# EAGLE design arduino_due_shield (EAGLE 9.2.2)
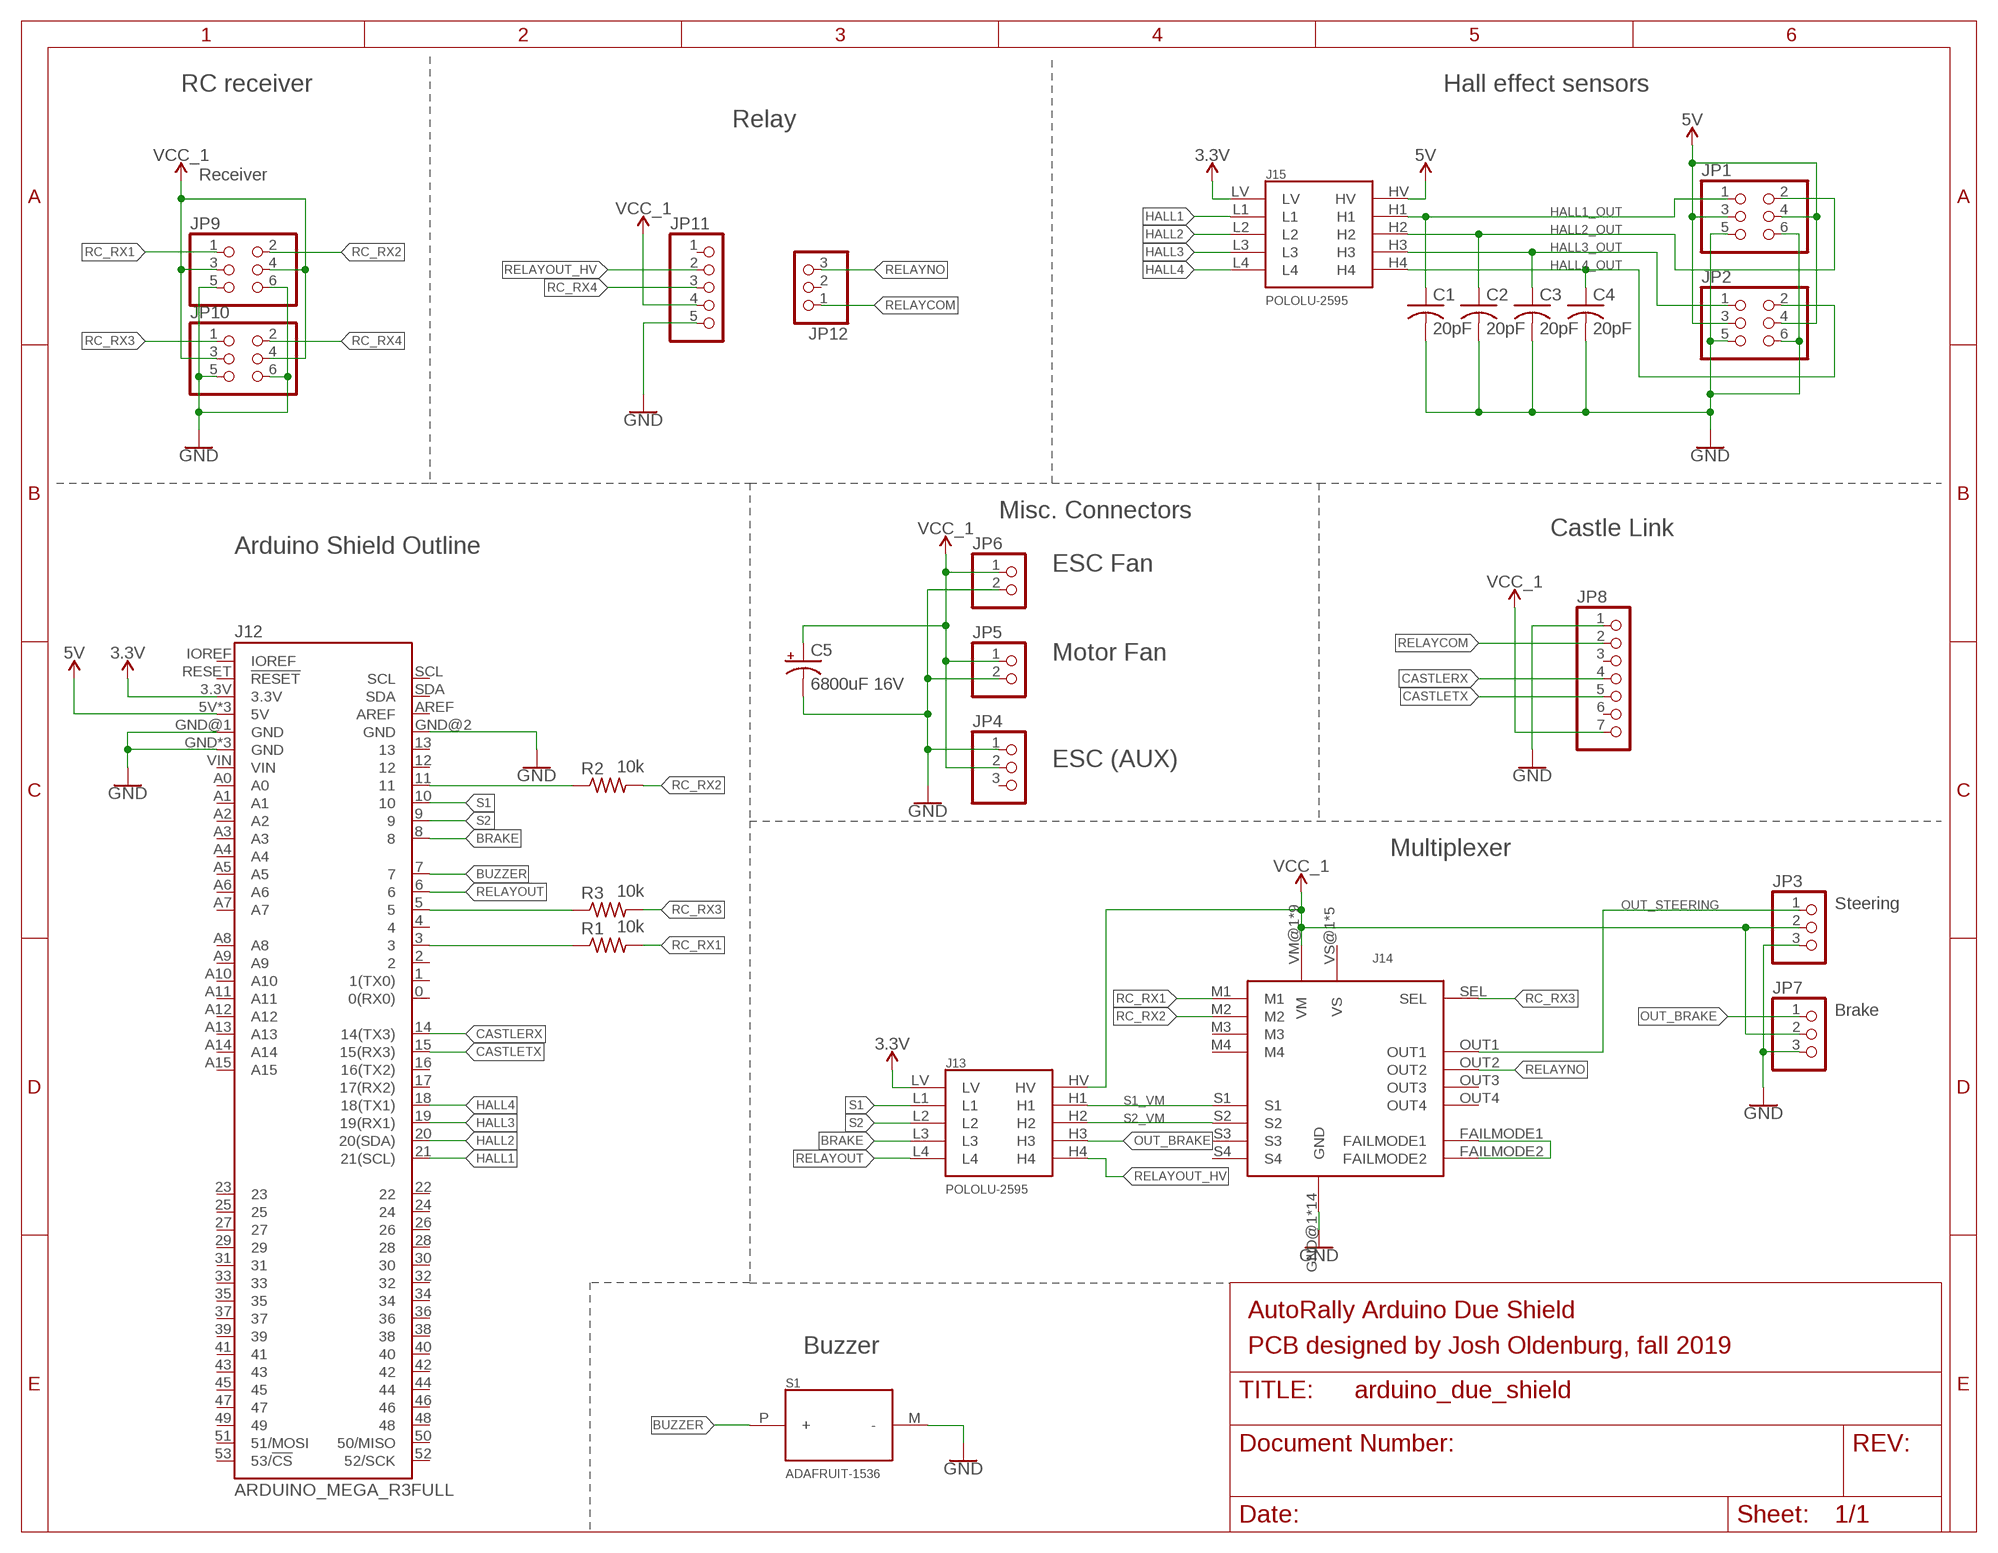
[diagram p0: schematic, sheet 1]

## Parts
C1  20pF  C-US025-030X050  [C025-030X050]
C2  20pF  C-US025-030X050  [C025-030X050]
C3  20pF  C-US025-030X050  [C025-030X050]
C4  20pF  C-US025-030X050  [C025-030X050]
C5  6800uF 16V  CPOL-USE7.5-16  [E7,5-16]
J12  ARDUINO_MEGA_R3FULL  [ARDUINO_MEGA_NO_SILK]
J13  POLOLU-2595  [POLOLU-2595-PTH]
J14  POLOLU-2807  [POLOLU-2807-PTH]
J15  POLOLU-2595  [POLOLU-2595-PTH]
JP1  PINHD-2X3  [2X03]
JP2  PINHD-2X3  [2X03]
JP3  PINHD-1X3  [1X03]
JP4  PINHD-1X3  [1X03]
JP5  PINHD-1X2  [1X02]
JP6  PINHD-1X2  [1X02]
JP7  PINHD-1X3  [1X03]
JP8  PINHD-1X7  [1X07]
JP9  PINHD-2X3  [2X03]
JP10  PINHD-2X3  [2X03]
JP11  PINHD-1X5  [1X05]
JP12  PINHD-1X3  [1X03]
R1  10k  R-US_0204/7  [0204/7]
R2  10k  R-US_0204/7  [0204/7]
R3  10k  R-US_0204/7  [0204/7]
S1  ADAFRUIT-1536  [ADAFRUIT-1536]

## Nets
3.3V: J12.3.3V J13.LV J15.LV
5V: J12.5V J12.5V@1(5V) J12.5V@2(5V) J15.HV JP1.3 JP1.4 JP2.3 JP2.4
BRAKE: J12.8 J13.L3
BUZZER: J12.7 S1.P(+)
CASTLERX: J12.14(14(TX3)) JP8.4
CASTLETX: J12.15(15(RX3)) JP8.5
GND: C1.2 C2.2 C3.2 C4.2 C5.- J12.GND J12.GND@1(GND) J12.GND@2(GND) J12.GND@3(GND) J12.GND@4(GND) J14.GND@1(GND) J14.GND@2(GND) J14.GND@3(GND) J14.GND@4(GND) J14.GND@5(GND) J14.GND@6(GND) J14.GND@7(GND) J14.GND@8(GND) J14.GND@9(GND) J14.GND@10(GND) J14.GND@11(GND) J14.GND@12(GND) J14.GND@13(GND) J14.GND@14(GND) JP1.5 JP1.6 JP2.5 JP2.6 JP3.3 JP4.1 JP5.2 JP6.2 JP7.3 JP8.1 JP9.5 JP9.6 JP10.5 JP10.6 JP11.5 S1.M(-)
HALL1: J12.21(21(SCL)) J15.L1
HALL1_OUT: C1.1 J15.H1 JP1.1
HALL2: J12.20(20(SDA)) J15.L2
HALL2_OUT: C2.1 J15.H2 JP1.2
HALL3: J12.19(19(RX1)) J15.L3
HALL3_OUT: C3.1 J15.H3 JP2.1
HALL4: J12.18(18(TX1)) J15.L4
HALL4_OUT: C4.1 J15.H4 JP2.2
N$1: J12.11 R2.1
N$2: J14.FAILMODE1 J14.FAILMODE2
N$10: J12.5 R3.1
N$11: J12.3 R1.1
OUT_BRAKE: J13.H3 JP7.1
OUT_STEERING: J14.OUT1 JP3.1
RC_RX1: J14.M1 JP9.1 R1.2
RC_RX2: J14.M2 JP9.2 R2.2
RC_RX3: J14.SEL JP10.1 R3.2
RC_RX4: JP10.2 JP11.3
RELAYCOM: JP8.2 JP12.1
RELAYNO: J14.OUT2 JP12.3
RELAYOUT: J12.6 J13.L4
RELAYOUT_HV: J13.H4 JP11.2
S1: J12.10 J13.L1
S1_VM: J13.H1 J14.S1
S2: J12.9 J13.L2
S2_VM: J13.H2 J14.S2
VCC_2: C5.+ J13.HV J14.VM@1(VM) J14.VM@2(VM) J14.VM@3(VM) J14.VM@4(VM) J14.VM@5(VM) J14.VM@6(VM) J14.VM@7(VM) J14.VM@8(VM) J14.VM@9(VM) JP3.2 JP4.2 JP5.1 JP6.1 JP7.2 JP8.7 JP9.3 JP9.4 JP10.3 JP10.4 JP11.4 ; supply symbol labelled VCC_1
Unconnected: J12.0(0(RX0)) J12.1(1(TX0)) J12.2 J12.4 J12.12 J12.13 J12.16(16(TX2)) J12.17(17(RX2)) J12.22 J12.23 J12.24 J12.25 J12.26 J12.27 J12.28 J12.29 J12.30 J12.31 J12.32 J12.33 J12.34 J12.35 J12.36 J12.37 J12.38 J12.39 J12.40 J12.41 J12.42 J12.43 J12.44 J12.45 J12.46 J12.47 J12.48 J12.49 J12.50(50/MISO) J12.51(51/MOSI) J12.52(52/SCK) J12.53(53/!CS) J12.A0 J12.A1 J12.A2 J12.A3 J12.A4 J12.A5 J12.A6 J12.A7 J12.A8 J12.A9 J12.A10 J12.A11 J12.A12 J12.A13 J12.A14 J12.A15 J12.AREF J12.IOREF J12.RESET(!RESET) J12.SCL J12.SDA J12.VIN J14.M3 J14.M4 J14.OUT3 J14.OUT4 J14.S3 J14.S4 J14.VS@1(VS) J14.VS@2(VS) J14.VS@3(VS) J14.VS@4(VS) J14.VS@5(VS) JP4.3 JP8.3 JP8.6 JP11.1 JP12.2

## Notes on the sheet
- RC receiver | Hall effect sensors
- Relay
- Receiver
- Misc. Connectors
- Castle Link
- Arduino Shield Outline
- ESC Fan
- Motor Fan
- ESC (AUX)
- Multiplexer
- Steering
- Brake
- AutoRally Arduino Due Shield
- Buzzer | PCB designed by Josh Oldenburg, fall 2019

## Library data of the parts
C1-C4 = resistor:C-US: CAPACITOR, American symbol
C5 = resistor:CPOL-US: POLARIZED CAPACITOR, American symbol
J12 = SparkFun-Boards:ARDUINO_MEGA_R3: Arduino Mega R3 ATmega2560 R3 compatible footprint. SparkFun Products: Arduino Mega 2560 R3 <https://www.sparkfun.com/products/11061>
J13 J15 = arduino_due_shield:POLOLU-2595: https://www.pololu.com/product/2595
J14 = arduino_due_shield:POLOLU-2807: https://www.pololu.com/product/2807
JP1 JP2 JP9 JP10 = pinhead:PINHD-2X3: PIN HEADER
JP3 JP4 JP7 JP12 = pinhead:PINHD-1X3: PIN HEADER
JP5 JP6 = pinhead:PINHD-1X2: PIN HEADER
JP8 = pinhead:PINHD-1X7: PIN HEADER
JP11 = pinhead:PINHD-1X5: PIN HEADER
R1-R3 = resistor:R-US_: RESISTOR, American symbol
S1 = arduino_due_shield:ADAFRUIT-1536: https://www.adafruit.com/product/1536

## Board
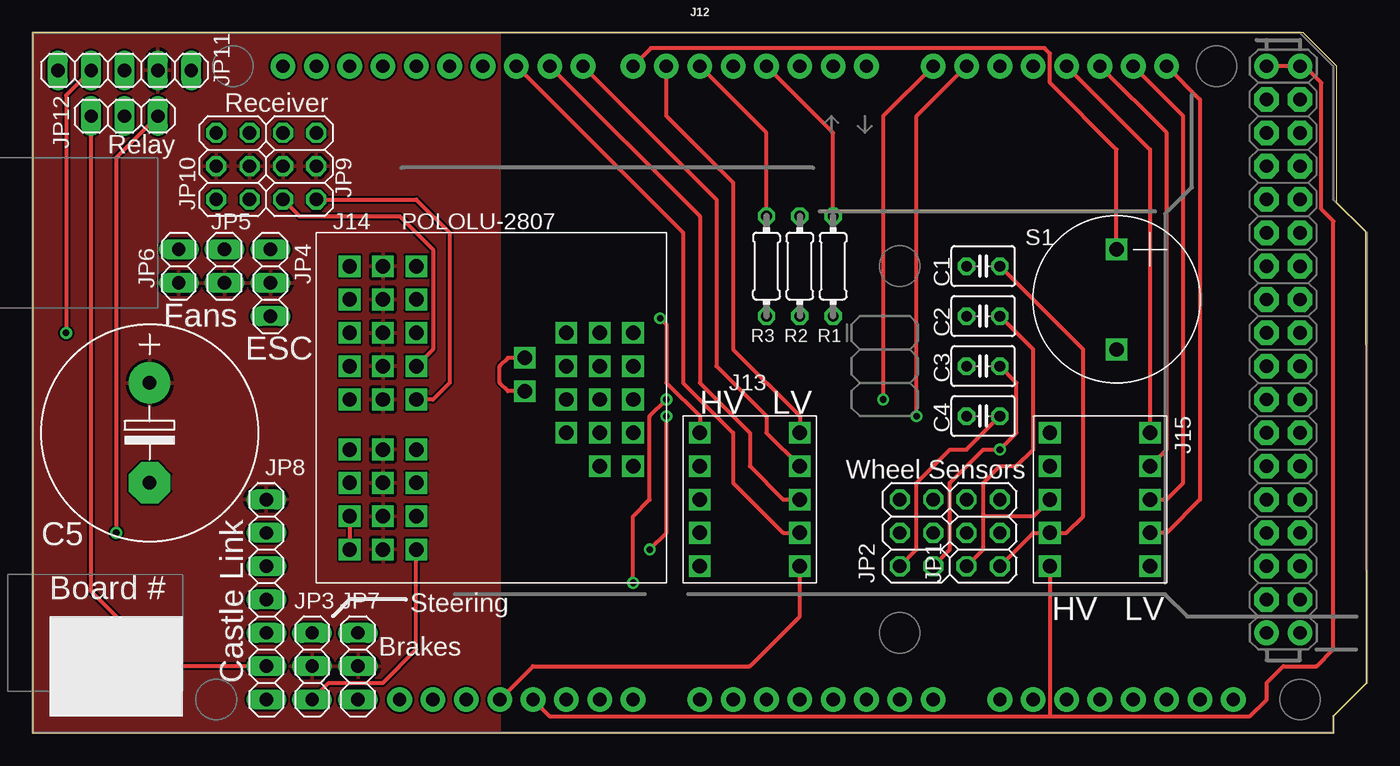
[diagram p1: board, top side]
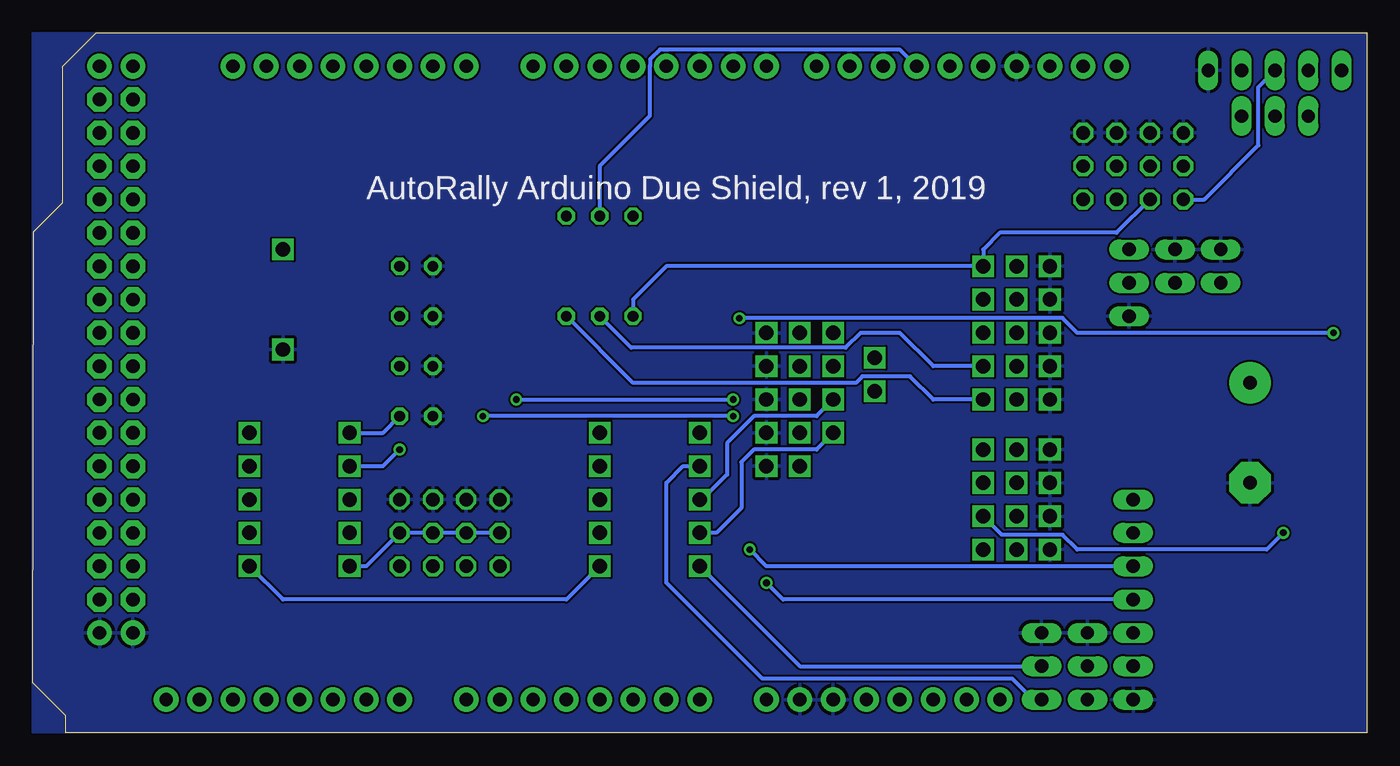
[diagram p2: board, bottom side, seen from below]

Size 101.6 x 53.34 mm. Coordinates in mm from the lower left corner, seen from the top.
Outline: 0,0 99.11,0 99.11,1.32 101.6,3.81 101.52,38.15 101.52,38.18 99.31,40.39 99.31,50.8 96.77,53.34 0,53.33 0,0
Copper layers (1*16): Top 0.0356mm / dielectric 63mil / Bottom 0.0356mm
Design rules "RJ2LayerDRU": minimum track width 6mil, minimum drill 15mil, track to track 6mil, track to pad 6mil, pad to pad 6mil, via to via 6mil, smd to smd 6mil, copper to edge 0mil, drill to drill 6mil, minimum pad ring 10mil, minimum via ring 8mil, stop-mask expansion 4mil, vias tented up to drill 0mil, thermal gap 10mil

### Footprints (pad centres in the part's own frame; a part is rotated, then mirrored left to right if it is on the bottom)
C025-030X050 = drill 0.813 octagon: 1 -1.27,0; 2 1.27,0
E7,5-16 = drill 1.016 pad 3.15: + -3.81,0 | drill 1.016 pad 3.15 octagon: - 3.81,0
ARDUINO_MEGA_NO_SILK = drill 1.016 pad 1.88: 0 13.97,24.13; 1 11.43,24.13; 2 8.89,24.13; 3 6.35,24.13; 3.3V -13.97,-24.13; 4 3.81,24.13; 5 1.27,24.13; 5V -11.43,-24.13; 5V@1 44.45,24.13; 5V@2 46.99,24.13; 6 -1.27,24.13; 7 -3.81,24.13; 8 -7.62,24.13; 9 -10.16,24.13; 10 -12.7,24.13; 11 -15.24,24.13; 12 -17.78,24.13; 13 -20.32,24.13; 14 19.05,24.13; 15 21.59,24.13; 16 24.13,24.13; 17 26.67,24.13; 18 29.21,24.13; 19 31.75,24.13; 20 34.29,24.13; 21 36.83,24.13; A0 1.27,-24.13; A1 3.81,-24.13; A2 6.35,-24.13; A3 8.89,-24.13; A4 11.43,-24.13; A5 13.97,-24.13; A6 16.51,-24.13; A7 19.05,-24.13; A8 24.13,-24.13; A9 26.67,-24.13; A10 29.21,-24.13; A11 31.75,-24.13; A12 34.29,-24.13; A13 36.83,-24.13; A14 39.37,-24.13; A15 41.91,-24.13; AREF -25.4,24.13; GND -8.89,-24.13; GND@1 -6.35,-24.13; GND@2 44.45,-19.05; GND@3 46.99,-19.05; GND@4 -22.86,24.13; IOREF -19.05,-24.13; NC -21.59,-24.13; RESET -16.51,-24.13; SCL -30.48,24.13; SDA -27.94,24.13; VIN -3.81,-24.13 | drill 1.016 pad 1.88 octagon: 22 44.45,21.59; 23 46.99,21.59; 24 44.45,19.05; 25 46.99,19.05; 26 44.45,16.51; 27 46.99,16.51; 28 44.45,13.97; 29 46.99,13.97; 30 44.45,11.43; 31 46.99,11.43; 32 44.45,8.89; 33 46.99,8.89; 34 44.45,6.35; 35 46.99,6.35; 36 44.45,3.81; 37 46.99,3.81; 38 44.45,1.27; 39 46.99,1.27; 40 44.45,-1.27; 41 46.99,-1.27; 42 44.45,-3.81; 43 46.99,-3.81; 44 44.45,-6.35; 45 46.99,-6.35; 46 44.45,-8.89; 47 46.99,-8.89; 48 44.45,-11.43; 49 46.99,-11.43; 50 44.45,-13.97; 51 46.99,-13.97; 52 44.45,-16.51; 53 46.99,-16.51
POLOLU-2595-PTH = drill 1.1 square: H1 7.62,7.62; H2 7.62,5.08; H3 7.62,2.54; H4 7.62,0; HV 7.62,10.16; L1 0,7.62; L2 0,5.08; L3 0,2.54; L4 0,0; LV 0,10.16
POLOLU-2807-PTH = drill 1.1 square: FAILMODE1 13.335,14.605; FAILMODE2 13.335,12.065; GND@1 0,21.59; GND@2 0,19.05; GND@3 0,16.51; GND@4 0,13.97; GND@5 0,11.43; GND@6 0,7.62; GND@7 0,5.08; GND@8 0,2.54; GND@9 0,0; GND@10 21.59,16.51; GND@11 21.59,13.97; GND@12 21.59,11.43; GND@13 21.59,8.89; GND@14 21.59,6.35; M1 5.08,11.43; M2 5.08,13.97; M3 5.08,16.51; M4 5.08,19.05; OUT1 5.08,0; OUT2 5.08,2.54; OUT3 5.08,5.08; OUT4 5.08,7.62; S1 16.51,8.89; S2 16.51,11.43; S3 16.51,13.97; S4 16.51,16.51; SEL 5.08,21.59; VM@1 2.54,21.59; VM@2 2.54,19.05; VM@3 2.54,16.51; VM@4 2.54,13.97; VM@5 2.54,11.43; VM@6 2.54,7.62; VM@7 2.54,5.08; VM@8 2.54,2.54; VM@9 2.54,0; VS@1 19.05,16.51; VS@2 19.05,13.97; VS@3 19.05,11.43; VS@4 19.05,8.89; VS@5 19.05,6.35
2X03 = drill 1.016 octagon: 1 -2.54,-1.27; 2 -2.54,1.27; 3 0,-1.27; 4 0,1.27; 5 2.54,-1.27; 6 2.54,1.27
1X03 = drill 1.016 long: 1 -2.54,0; 2 0,0; 3 2.54,0
1X02 = drill 1.016 long: 1 -1.27,0; 2 1.27,0
1X07 = drill 1.016 long: 1 -7.62,0; 2 -5.08,0; 3 -2.54,0; 4 0,0; 5 2.54,0; 6 5.08,0; 7 7.62,0
1X05 = drill 1.016 long: 1 -5.08,0; 2 -2.54,0; 3 0,0; 4 2.54,0; 5 5.08,0
0204/7 = drill 0.813 octagon: 1 -3.81,0; 2 3.81,0
ADAFRUIT-1536 = drill 1.1 square: M 7.62,0; P 0,0

### Placement (x,y rotation side)
C1  72.39,35.56 180 top
C2  72.39,31.75 180 top
C3  72.39,27.94 180 top
C4  72.39,24.13 180 top
C5  8.89,22.86 270 top
J12  49.53,26.67 0 top
J13  58.42,22.86 180 top
J14  24.13,13.97 0 top
J15  85.09,22.86 180 top
JP1  72.39,15.24 90 top
JP2  67.31,15.24 90 top
JP3  21.27,5.08 90 top
JP4  18.1,34.29 90 top
JP5  14.61,35.56 90 top
JP6  11.11,35.56 90 top
JP7  24.77,5.08 90 top
JP8  17.78,10.16 90 top
JP9  20.32,43.18 90 top
JP10  15.24,43.18 90 top
JP11  6.99,50.48 0 top
JP12  6.99,46.99 0 top
R1  60.96,35.56 270 top
R2  58.42,35.56 270 top
R3  55.88,35.56 270 top
S1  82.55,36.83 270 top

### Tracks (layer width: path | path; a pad name or v marks a point on that pad's centre or on a via)
3.3V
  Top 0.305: J12.3.3V 38.1,5.08 54.61,5.08 58.42,8.89 J13.LV
  Bottom 0.305: J13.LV 60.96,10.16 82.55,10.16 J15.LV
5V
  Top 0.305: J12.5V 39.37,1.27 77.47,1.27 | 77.47,1.27 92.71,1.27 93.98,2.54 93.98,3.81 95.25,5.08 97.79,5.08 99.06,6.35 99.06,38.99 98.15,39.9 98.15,49.53 96.88,50.8 J12.5V@2 J12.5V@1 | J15.HV 77.47,1.27
  Bottom 0.305: JP2.4 JP2.3 JP1.4 JP1.3 76.2,12.7 J15.HV
BRAKE
  Top 0.305: J13.L3 55.88,22.86 55.88,24.13 52.07,27.94 52.07,40.64 J12.8
BUZZER
  Top 0.305: S1.P 82.55,44.45 77.47,49.53 77.47,51.75 77.05,52.17 66.04,52.17 | 66.04,52.17 65.41,52.17 | 66.04,52.17 47.09,52.17 J12.7
CASTLERX  (via drill 0.5)
  Top 0.305: J12.14 64.77,46.99 v64.77,25.4 | v48.26,25.4 46.99,24.13 46.99,17.78 45.72,16.51 v45.72,11.43
  Bottom 0.305: v64.77,25.4 v48.26,25.4 | JP8.4 44.45,10.16 v45.72,11.43
CASTLETX  (via drill 0.5)
  Top 0.305: v46.99,13.97 48.26,15.24 v48.26,24.13 | J12.15 67.31,46.99 v67.31,24.13
  Bottom 0.305: JP8.5 45.72,12.7 v46.99,13.97 | v48.26,24.13 v67.31,24.13
GND
  Top 0.305: J14.GND@8 J14.GND@9
  pour Bottom: 0,0 101.6,0 101.6,53.34 0,53.34
HALL1
  Top 0.305: J12.21 88.9,48.26 88.9,17.78 86.36,15.24 J15.L1
HALL1_OUT
  Top 0.305: JP1.1 76.2,15.24 J15.H1 78.74,15.24 80.01,16.51 80.01,29.21 C1.1
HALL2
  Top 0.305: J15.L2 86.36,17.78 87.63,19.05 87.63,46.99 J12.20
HALL2_OUT
  Top 0.305: JP1.2 72.39,13.97 72.39,16.51 | 72.39,16.51 72.39,19.05 73.66,20.32 74.93,20.32 76.2,21.59 76.2,29.21 C2.1 | J15.H2 76.2,16.51 72.39,16.51
HALL3
  Top 0.305: J15.L3 86.36,21.59 86.36,45.72 J12.19
HALL3_OUT  (via drill 0.5)
  Top 0.305: JP2.1 69.85,13.97 69.85,19.05 72.39,21.59 v73.66,21.59 74.93,22.86 74.93,26.67 C3.1
  Bottom 0.305: J15.H3 74.93,20.32 v73.66,21.59
HALL4
  Top 0.305: J12.18 85.09,44.45 J15.L4
HALL4_OUT
  Top 0.305: JP2.2 67.31,13.97 67.31,19.05 69.85,21.59 71.12,21.59 C4.1
  Bottom 0.305: J15.H4 74.93,22.86 C4.1
N$1
  Bottom 0.305: J12.11 35.56,52.07 53.83,52.07 54.59,51.32 54.59,50.83 54.61,50.8 54.61,46.99 58.42,43.18 R2.1
N$2
  Top 0.305: J14.FAILMODE1 36.2,28.57 35.56,27.94 35.56,26.67 36.2,26.04 J14.FAILMODE2
N$10
  Top 0.305: R3.1 55.88,45.72 J12.5
N$11
  Top 0.305: R1.1 60.96,45.72 J12.3
OUT_BRAKE
  Bottom 0.305: JP7.1 25.4,2.54 26.99,4.13 46.04,4.13 53.34,11.43 53.34,19.05 52.07,20.32 J13.H3
OUT_STEERING
  Top 0.305: JP3.1 22.54,3.81 26.67,3.81 29.21,6.35 J14.OUT1
RC_RX1
  Top 0.305: J14.M1 30.48,25.4 31.75,26.67 31.75,38.1 29.21,40.64 JP9.1
  Bottom 0.305: J14.M1 33.02,25.4 34.78,27.16 38.42,27.16 38.91,26.67 55.88,26.67 R1.2
RC_RX2
  Top 0.305: JP9.2 20.32,39.37 27.94,39.37 30.48,36.83 30.48,29.21 J14.M2
  Bottom 0.305: J14.M2 33.02,27.94 35.56,30.48 38.56,30.48 39.69,29.35 56.02,29.35 R2.2
RC_RX3
  Bottom 0.305: JP10.1 19.05,38.1 27.94,38.1 29.21,36.83 J14.SEL 53.34,35.56 55.88,33.02 R3.2
RC_RX4
  Bottom 0.305: JP11.3 8.26,49.21 8.26,44.77 12.38,40.64 JP10.2
RELAYCOM
  Top 0.305: JP8.2 10.16,5.08 4.45,10.79 JP12.1
RELAYNO  (via drill 0.5)
  Top 0.305: JP12.3 6.35,43.81 v6.35,15.24
  Bottom 0.305: v6.35,15.24 7.62,13.97 22.05,13.97 23.18,15.1 27.8,15.1 J14.OUT2
RELAYOUT
  Top 0.305: J12.6 48.26,46.99 53.34,41.91 53.34,29.21 58.42,24.13 J13.L4
RELAYOUT_HV  (via drill 0.5)
  Top 0.305: JP11.2 2.54,48.58 v2.54,30.48 | v47.78,31.59 48.26,31.11 48.26,26.67 50.8,24.13 J13.H4
  Bottom 0.305: v2.54,30.48 22.05,30.48 23.18,31.61 47.77,31.61 v47.78,31.59
S1
  Top 0.305: J12.10 49.53,38.1 49.53,26.67 53.34,22.86 53.34,19.05 57.15,15.24 J13.L1
S1_VM
  Bottom 0.305: J14.S1 41.91,21.59 46.67,21.59 47.62,20.64 47.62,17.14 49.53,15.24 J13.H1
S2
  Top 0.305: J12.9 50.8,39.37 50.8,26.67 54.61,22.86 54.61,20.32 57.15,17.78 J13.L2
S2_VM
  Bottom 0.305: J14.S2 41.91,24.13 46.67,24.13 48.72,22.09 48.72,19.69 50.62,17.78 J13.H2
VCC_2
  Bottom 0.305: JP7.2 43.18,5.08 J13.HV
  pour Top: 0,53.34 35.56,53.34 35.56,0 0,0

### Text on the board
tPlace: Receiver | Relay | Fans | ESC | HV LV | Wheel Sensors | Board # | Steering | HV LV | Brakes | Castle Link
bPlace: AutoRally Arduino Due Shield, rev 1, 2019